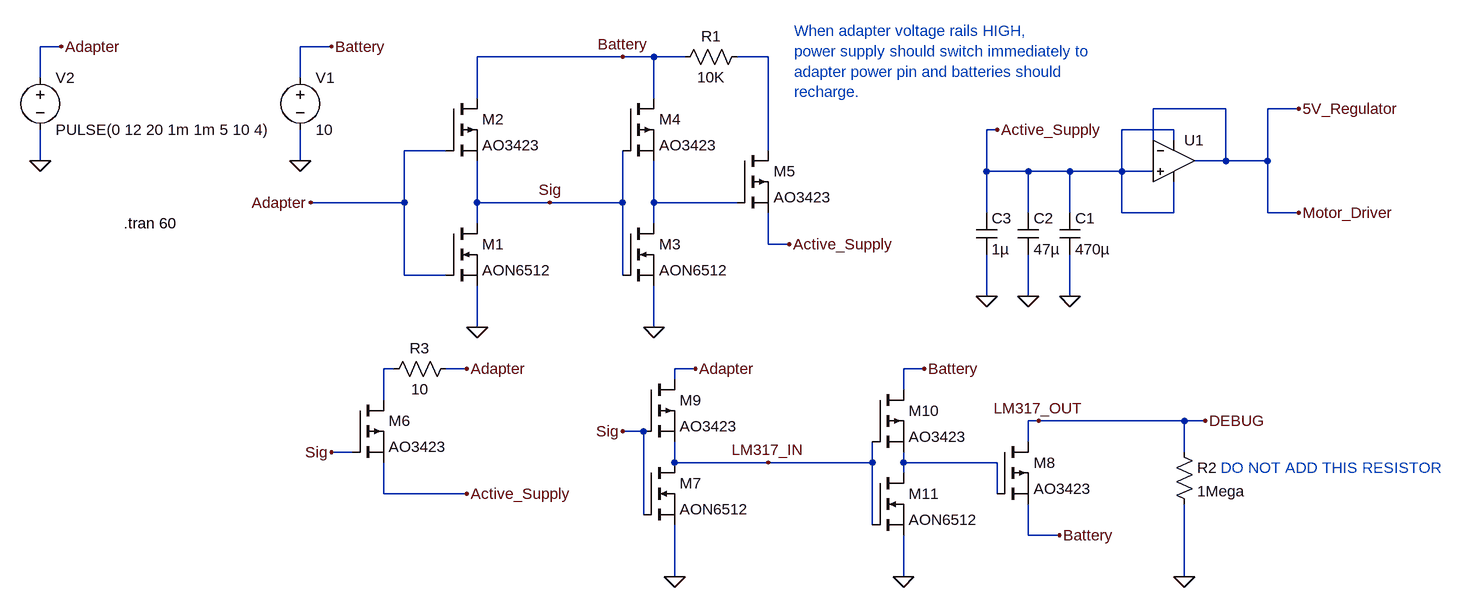
[diagram p0: schematic Design 1.asc]
Design 1.asc, the LTspice schematic file:
Version 4
SHEET 1 1536 1612
WIRE -768 352 -800 352
WIRE -352 352 -400 352
WIRE 96 368 -128 368
WIRE 144 368 96 368
WIRE 192 368 144 368
WIRE 320 368 272 368
WIRE -800 400 -800 352
WIRE -400 400 -400 352
WIRE -128 432 -128 368
WIRE 144 432 144 368
WIRE 1024 448 912 448
WIRE 1136 448 1088 448
WIRE 672 480 656 480
WIRE 944 480 864 480
WIRE 944 496 944 480
WIRE -176 512 -240 512
WIRE 320 512 320 368
WIRE 912 512 912 448
WIRE -800 528 -800 480
WIRE -400 528 -400 480
WIRE 1024 528 1024 448
WIRE 1024 528 976 528
WIRE 1088 528 1088 448
WIRE 1088 528 1024 528
WIRE 656 544 656 480
WIRE 720 544 656 544
WIRE 784 544 720 544
WIRE 864 544 864 480
WIRE 864 544 784 544
WIRE 912 544 864 544
WIRE -240 592 -240 512
WIRE -240 592 -384 592
WIRE -128 592 -128 528
WIRE -16 592 -128 592
WIRE 96 592 96 512
WIRE 96 592 -16 592
WIRE 144 592 144 528
WIRE 272 592 144 592
WIRE 656 608 656 544
WIRE 720 608 720 544
WIRE 784 608 784 544
WIRE 864 608 864 544
WIRE 944 608 944 560
WIRE 944 608 864 608
WIRE 1088 608 1088 528
WIRE 1136 608 1088 608
WIRE -128 624 -128 592
WIRE 144 624 144 592
WIRE 320 656 320 608
WIRE 352 656 320 656
WIRE -240 704 -240 592
WIRE -176 704 -240 704
WIRE 96 704 96 592
WIRE 656 736 656 672
WIRE 720 736 720 672
WIRE 784 736 784 672
WIRE -128 784 -128 720
WIRE 144 784 144 720
WIRE -256 848 -272 848
WIRE -144 848 -176 848
WIRE 208 848 176 848
WIRE 560 848 528 848
WIRE 176 864 176 848
WIRE 528 880 528 848
WIRE -272 896 -272 848
WIRE 736 928 720 928
WIRE 960 928 736 928
WIRE 992 928 960 928
WIRE 128 944 96 944
WIRE 720 960 720 928
WIRE -320 976 -352 976
WIRE 960 976 960 928
WIRE 176 992 176 960
WIRE 320 992 176 992
WIRE 480 992 480 960
WIRE 480 992 320 992
WIRE 528 992 528 976
WIRE 672 992 528 992
WIRE 528 1008 528 992
WIRE -272 1040 -272 992
WIRE -144 1040 -272 1040
WIRE 672 1040 672 992
WIRE 128 1072 128 944
WIRE 480 1088 480 992
WIRE 720 1104 720 1056
WIRE 768 1104 720 1104
WIRE 176 1168 176 1088
WIRE 528 1168 528 1104
WIRE 960 1168 960 1056
FLAG 320 992 LM317_IN
FLAG 1136 608 Motor_Driver
FLAG 1136 448 5V_Regulator
FLAG -384 592 Adapter
FLAG -128 784 0
FLAG 96 368 Battery
FLAG 656 736 0
FLAG 720 736 0
FLAG 784 736 0
FLAG 672 480 Active_Supply
FLAG 144 784 0
FLAG 352 656 Active_Supply
FLAG -144 848 Adapter
FLAG -144 1040 Active_Supply
FLAG 736 928 LM317_OUT
FLAG 176 1168 0
FLAG 768 1104 Battery
FLAG -16 592 Sig
FLAG -352 976 Sig
FLAG 96 944 Sig
FLAG -352 352 Battery
FLAG -400 528 0
FLAG -768 352 Adapter
FLAG -800 528 0
FLAG 528 1168 0
FLAG 960 1168 0
FLAG 992 928 DEBUG
FLAG 560 848 Battery
FLAG 208 848 Adapter
SYMBOL nmos -176 624 R0
SYMATTR InstName M1
SYMATTR Value AON6512
SYMBOL pmos -176 432 R0
SYMATTR InstName M2
SYMATTR Value AO3423
SYMBOL cap 768 608 R0
SYMATTR InstName C1
SYMATTR Value 470µ
SYMBOL cap 704 608 R0
SYMATTR InstName C2
SYMATTR Value 47µ
SYMBOL cap 640 608 R0
SYMATTR InstName C3
SYMATTR Value 1µ
SYMBOL pmos 96 432 R0
SYMATTR InstName M4
SYMATTR Value AO3423
SYMBOL nmos 96 624 R0
SYMATTR InstName M3
SYMATTR Value AON6512
SYMBOL nmos 128 992 R0
SYMATTR InstName M7
SYMATTR Value AON6512
SYMBOL pmos 128 864 R0
SYMATTR InstName M9
SYMATTR Value AO3423
SYMBOL pmos 272 512 R0
SYMATTR InstName M5
SYMATTR Value AO3423
SYMBOL pmos 672 960 R0
SYMATTR InstName M8
SYMATTR Value AO3423
SYMBOL pmos -320 896 R0
SYMATTR InstName M6
SYMATTR Value AO3423
SYMBOL voltage -400 384 R0
SYMATTR InstName V1
SYMATTR Value 10
SYMBOL voltage -800 384 R0
WINDOW 123 0 0 Left 0
WINDOW 39 0 0 Left 0
SYMATTR InstName V2
SYMATTR Value PULSE(0 12 20 1m 1m 5 10 4)
SYMBOL pmos 480 880 R0
SYMATTR InstName M10
SYMATTR Value AO3423
SYMBOL nmos 480 1008 R0
SYMATTR InstName M11
SYMATTR Value AON6512
SYMBOL res 944 960 R0
SYMATTR InstName R2
SYMATTR Value 1Mega
SYMBOL res 288 352 R90
WINDOW 0 0 56 VBottom 2
WINDOW 3 32 56 VTop 2
SYMATTR InstName R1
SYMATTR Value 10K
SYMBOL res -160 832 R90
WINDOW 0 0 56 VBottom 2
WINDOW 3 32 56 VTop 2
SYMATTR InstName R3
SYMATTR Value 10
SYMBOL OpAmps\\UniversalOpamp2 944 528 R0
SYMATTR InstName U1
TEXT 360 328 Left 2 ;When adapter voltage rails HIGH, \npower supply should switch immediately to \nadapter power pin and batteries should\nrecharge.
TEXT -672 624 Left 2 !.tran 60
TEXT 1016 1000 Left 2 ;DO NOT ADD THIS RESISTOR

The netlist it stands for:
* Design 1.asc
M1 Sig Adapter 0 0 AON6512
M2 Battery Adapter Sig Sig AO3423
C1 Active_Supply 0 470µ
C2 Active_Supply 0 47µ
C3 Active_Supply 0 1µ
M4 Battery Sig N002 N002 AO3423
M3 N002 Sig 0 0 AON6512
M7 LM317_IN Sig 0 0 AON6512
M9 Adapter Sig LM317_IN LM317_IN AO3423
M5 N001 N002 Active_Supply Active_Supply AO3423
M8 DEBUG N004 Battery Battery AO3423
M6 N003 Sig Active_Supply Active_Supply AO3423
V1 Battery 0 10
V2 Adapter 0 PULSE(0 12 20 1m 1m 5 10 4)
M10 Battery LM317_IN N004 N004 AO3423
M11 N004 LM317_IN 0 0 AON6512
R2 DEBUG 0 1Mega
R1 N001 Battery 10K
R3 Adapter N003 10
XU1 Active_Supply 5V_Regulator Active_Supply Active_Supply 5V_Regulator level.2 Avol=1Meg GBW=10Meg Slew=10Meg ilimit=25m rail=0 Vos=0 phimargin=45 en=0 enk=0 in=0 ink=0 Rin=500Meg  ; pins IN+ IN- V+ V- OUT
.model NMOS NMOS
.model PMOS PMOS
.lib standard.mos
* When adapter voltage rails HIGH,
* power supply should switch immediately to
* adapter power pin and batteries should
* recharge.
.tran 60
* DO NOT ADD THIS RESISTOR
.lib UniversalOpamps2.sub
.backanno
.end